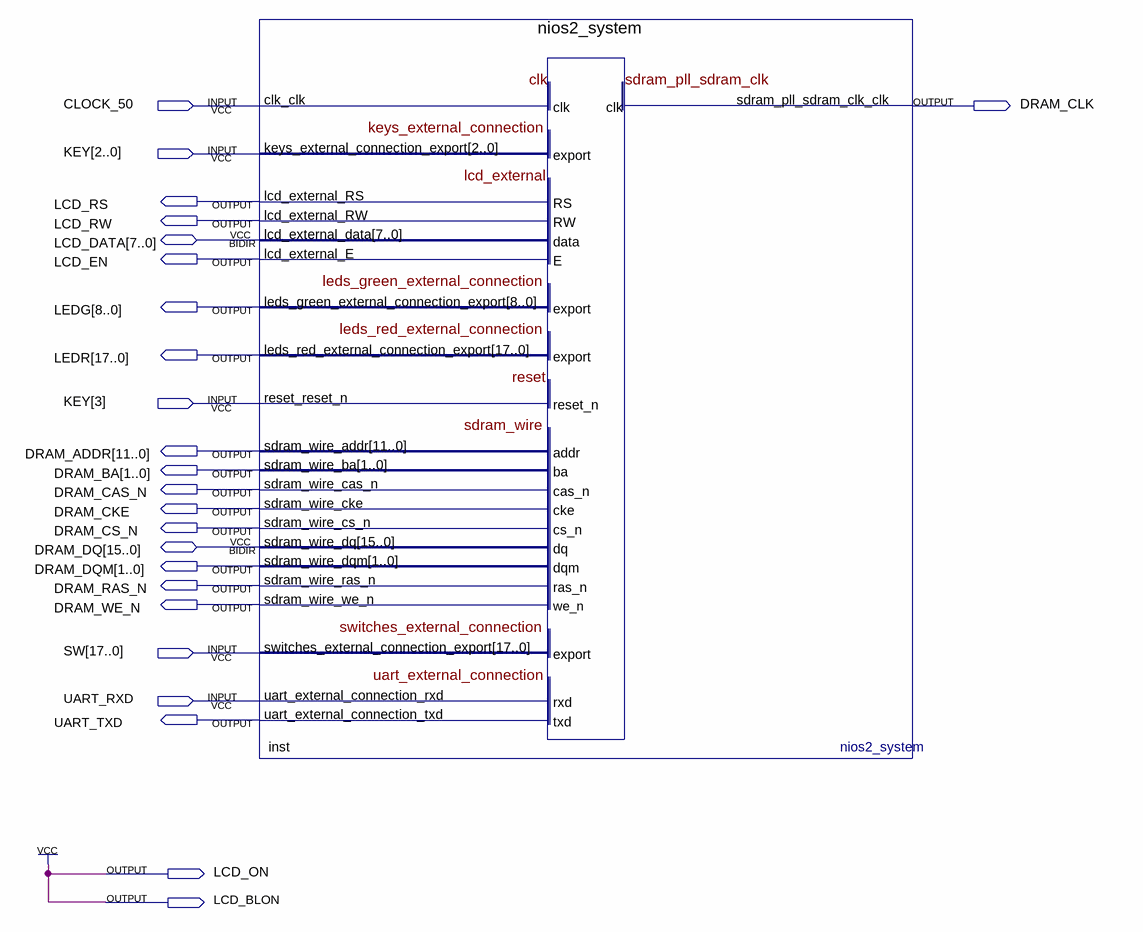
[diagram p0: schematic sheet]
// Quartus schematic Lab1.bdf as structural Verilog: 1 symbols, 24 pins
module Lab1 (
  input  CLOCK_50,
  input  [3:0] KEY,
  input  [17:0] SW,
  input  UART_RXD,
  inout  [7:0] LCD_DATA,
  inout  [15:0] DRAM_DQ,
  output DRAM_CLK,
  output LCD_RS,
  output LCD_RW,
  output LCD_EN,
  output [8:0] LEDG,
  output [17:0] LEDR,
  output [11:0] DRAM_ADDR,
  output [1:0] DRAM_BA,
  output DRAM_CAS_N,
  output DRAM_CKE,
  output DRAM_CS_N,
  output [1:0] DRAM_DQM,
  output DRAM_RAS_N,
  output DRAM_WE_N,
  output UART_TXD,
  output LCD_ON,
  output LCD_BLON
);

  nios2_system inst (
    .clk_clk(CLOCK_50), .keys_external_connection_export(KEY[2:0]), .reset_reset_n(KEY[3]),
    .switches_external_connection_export(SW), .uart_external_connection_rxd(UART_RXD),
    .lcd_external_RS(LCD_RS), .lcd_external_RW(LCD_RW), .lcd_external_E(LCD_EN),
    .leds_green_external_connection_export(LEDG), .leds_red_external_connection_export(LEDR),
    .sdram_pll_sdram_clk_clk(DRAM_CLK), .sdram_wire_addr(DRAM_ADDR), .sdram_wire_ba(DRAM_BA),
    .sdram_wire_cas_n(DRAM_CAS_N), .sdram_wire_cke(DRAM_CKE), .sdram_wire_cs_n(DRAM_CS_N),
    .sdram_wire_dqm(DRAM_DQM), .sdram_wire_ras_n(DRAM_RAS_N), .sdram_wire_we_n(DRAM_WE_N),
    .uart_external_connection_txd(UART_TXD), .lcd_external_data(LCD_DATA), .sdram_wire_dq(DRAM_DQ));

  assign LCD_BLON = 1'b1;
  assign LCD_ON = 1'b1;
endmodule
